# EAGLE design Fyre-BASIC-BOTtom (EAGLE 9.6.2)
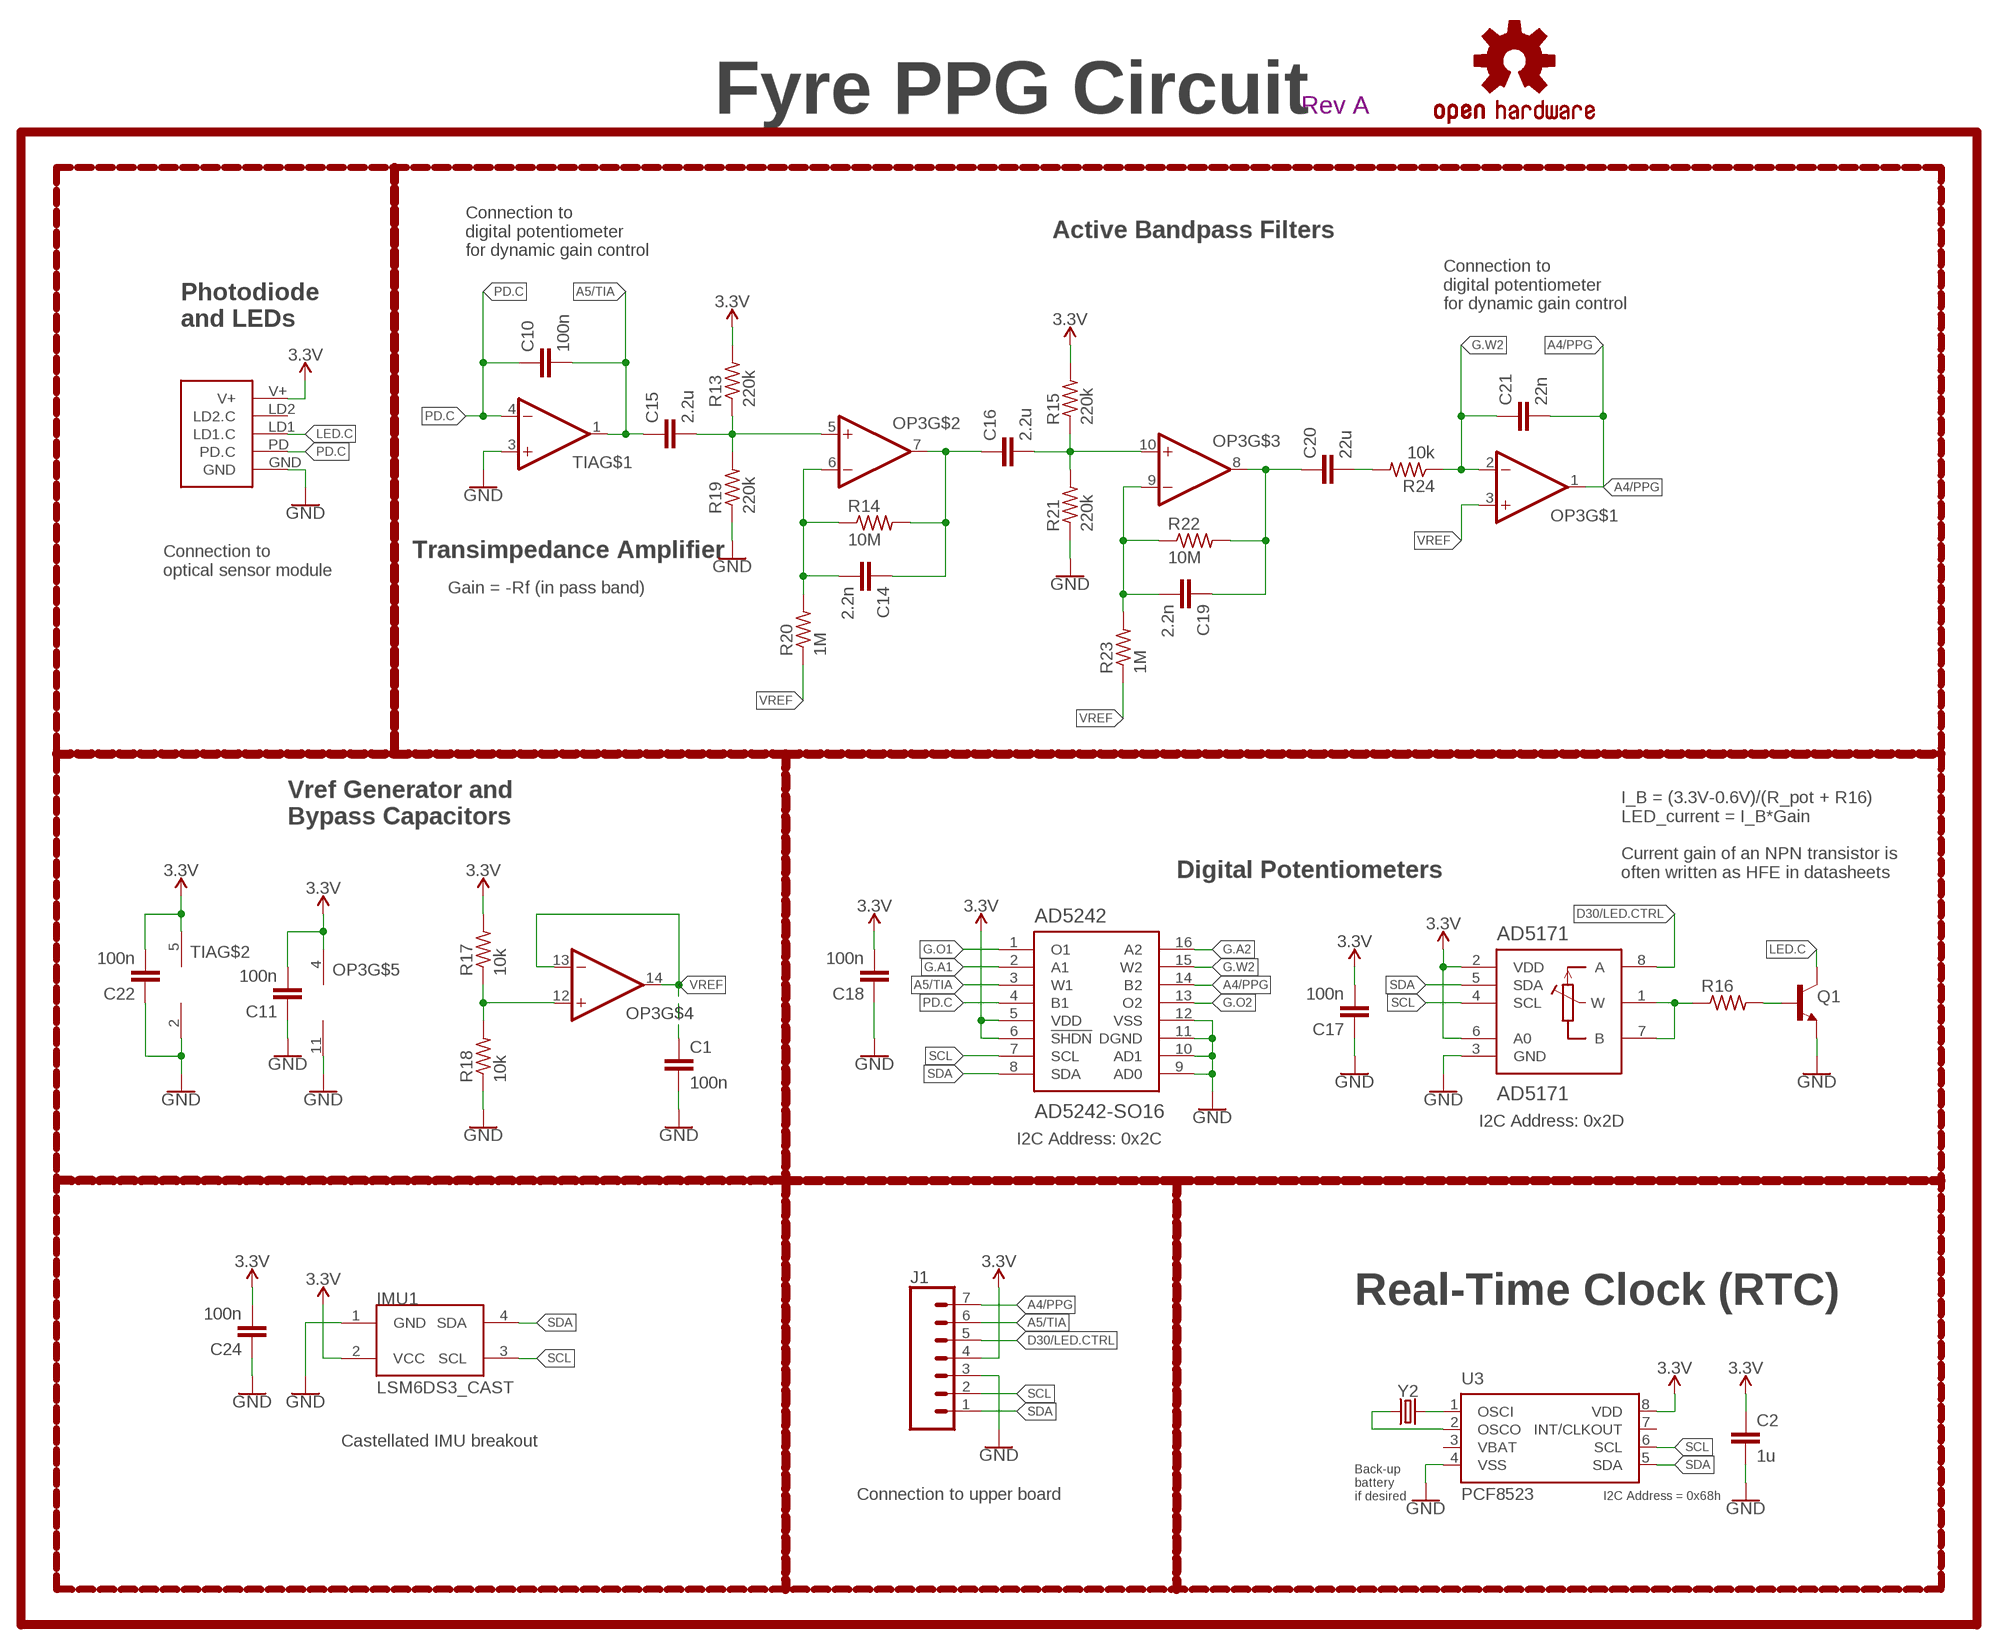
[diagram p0: schematic, sheet 1]

## Parts
AD5171  AD5171  [SOT-23-8]
AD5242  AD5242-SO16  [SO16]
C1  100n  CAPACITOR0603  [C0603]
C2  1u  CAPACITOR0603  [C0603]
C10  100n  CAPACITOR0603  [C0603]
C11  100n  CAPACITOR0603  [C0603]
C14  2.2n  CAPACITOR0603  [C0603]
C15  2.2u  CAPACITOR0603  [C0603]
C16  2.2u  CAPACITOR0603  [C0603]
C17  100n  CAPACITOR0603  [C0603]
C18  100n  CAPACITOR0603  [C0603]
C19  2.2n  CAPACITOR0603  [C0603]
C20  22u  CAPACITOR0603  [C0603]
C21  22n  CAPACITOR0603  [C0603]
C22  100n  CAPACITOR0603  [C0603]
C24  100n  CAPACITOR0603  [C0603]
IMU1  LSM6DS3_CAST  [LSM6DS3_CAST]
J1  CONN_07-1.27MM  [1X07_1.27MM]
LOGO1  REVISION.A  [REV.A]
LOGO2  OSHW-LOGOS  [OSHW-LOGO-S]
OP3  OP-QUAD-SO14  [SO14]
Q1  NPN-GENERIC  [SOT23-3]
R13  220k  RESISTOR0603  [R0603]
R14  10M  RESISTOR0603  [R0603]
R15  220k  RESISTOR0603  [R0603]
R16  RESISTOR0603  [R0603]
R17  10k  RESISTOR0402  [R0402]
R18  10k  RESISTOR0402  [R0402]
R19  220k  RESISTOR0603  [R0603]
R20  1M  RESISTOR0603  [R0603]
R21  220k  RESISTOR0603  [R0603]
R22  10M  RESISTOR0603  [R0603]
R23  1M  RESISTOR0603  [R0603]
R24  10k  RESISTOR0603  [R0603]
TIA  OP-SINGLEOT  [SOT23-5]
U3  PCF8523  [SO8]
U$3  PPG.MODULE.2  [PPG.MODULE.2]
Y2  32.7680kHz  CRYSTALECS-.327-12.5-12-C-TR  [2-SMD.NOLEAD.2.0MMTO1.2MM]

## Nets
3.3V: AD5171.2(VDD) AD5171.6(A0) AD5242.5(VDD) AD5242.6(!SHDN) C2.1 C11.2 C17.2 C18.2 C22.2 C24.2 IMU1.2(VCC) J1.4 OP3.4(V+) R13.2 R15.2 R17.2 TIA.5(V+) U3.8(VDD) U$3.V+
A4/PPG: AD5242.14(B2) C21.2 J1.7 OP3.1(OUT)
A5/TIA: AD5242.3(W1) C10.2 C15.1 J1.6 TIA.1(OUT)
D30/LED.CTRL: AD5171.8(A) J1.5
G.A1: AD5242.2(A1)
G.A2: AD5242.16(A2)
G.O1: AD5242.1(O1)
G.O2: AD5242.13(O2)
G.W2: AD5242.15(W2) C21.1 OP3.2(-IN) R24.1
GND: AD5171.3(GND) AD5242.9(AD0) AD5242.10(AD1) AD5242.11(DGND) AD5242.12(VSS) C1.2 C2.2 C11.1 C17.1 C18.1 C22.1 C24.1 IMU1.1(GND) J1.3 OP3.11(V-) Q1.2(E) R18.1 R19.1 R21.1 TIA.2(V-) TIA.3(+IN) U3.4(VSS) U$3.GND
LED.C: Q1.3(C) U$3.LD1(LD1.C)
N$1: U3.1(OSCI) Y2.P$2
N$6: U3.2(OSCO) Y2.P$1
N$8: Q1.1(B) R16.2
N$9: AD5171.1(W) AD5171.7(B) R16.1
N$10: OP3.12(+IN) R17.1 R18.2
N$13: C15.2 OP3.5(+IN) R13.1 R19.2
N$15: C14.2 OP3.6(-IN) R14.1 R20.2
N$16: C14.1 C16.1 OP3.7(OUT) R14.2
N$17: C16.2 OP3.10(+IN) R15.1 R21.2
N$18: C19.2 OP3.9(-IN) R22.1 R23.2
N$19: C19.1 C20.1 OP3.8(OUT) R22.2
N$20: C20.2 R24.2
PD.C: AD5242.4(B1) C10.1 TIA.4(-IN) U$3.PD(PD.C)
SCL: AD5171.4(SCL) AD5242.7(SCL) IMU1.3(SCL) J1.2 U3.6(SCL)
SDA: AD5171.5(SDA) AD5242.8(SDA) IMU1.4(SDA) J1.1 U3.5(SDA)
VREF: C1.1 OP3.3(+IN) OP3.13(-IN) OP3.14(OUT) R20.1 R23.1
Unconnected: U3.7(INT/CLKOUT) U$3.LD2(LD2.C)

## Notes on the sheet
- Fyre PPG Circuit
- Active Bandpass Filters
- Connection to
  digital potentiometer
  for dynamic gain control
- Connection to
  digital potentiometer
  for dynamic gain control
- Photodiode
  and LEDs
- Transimpedance Amplifier
- Connection to
  optical sensor module
- Gain = -Rf (in pass band)
- Vref Generator and
  Bypass Capacitors
- Digital Potentiometers
- I_B = (3.3V-0.6V)/(R_pot + R16)
  LED_current = I_B*Gain
  
  Current gain of an NPN transistor is
  often written as HFE in datasheets
- I2C Address: 0x2D
- I2C Address: 0x2C
- Real-Time Clock (RTC)
- Castellated IMU breakout
- Connection to upper board
- Back-up
  battery
  if desired
- I2C Address = 0x68h

## Power pins joined to a net without a drawn wire
VBAT: U3.3(VBAT)

## Library data of the parts
AD5171 = LinnesLab-DigitalIC:AD5171
AD5242 = LinnesLab-DigitalIC:AD5242
C1 C2 C10 C11 C14-C22 C24 = LinnesLab-Passives:CAPACITOR
IMU1 = LinnesLab-Sensors:LSM6DS3_CAST
J1 = LinnesLab-Connectors:CONN_07: Multi connection point. Often used as Generic Header-pin footprint for 0.1 inch spaced/style header connections On any of the 0.1 inch spaced packages, you can populate with these: Break Away Headers - Straight <https://www.sparkfun.com/products/116> (PRT-00116) Break Away Male Headers - Right Angle <https://www.sparkfun.com/products/553> (PRT-00553) Female Headers <https://www.sparkfun.com/products/115> (PRT-00115) Break Away Headers - Machine Pin <https://www.sparkfun.com/products/117> (PRT-00117) Break Away Female Headers - Swiss Machine Pin <https://www.sparkfun.com/products/743> (PRT-00743) For SCREWTERMINALS and SPRING TERMINALS visit here: Screw Terimnals on SparkFun.com <https://www.sparkfun.com/search/results?term=Screw+Terminals> (5mm/3.5mm/2.54mm spacing) This device is also useful as a general connection point to wire up your design to another part of your project. Our various solder wires solder well into these plated through hole pads. Hook-Up Wire - Assortment (Stranded, 22 AWG) <https://www.sparkfun.com/products/11375> (PRT-11375) Hook-Up Wire - Assortment (Solid Core, 22 AWG) <https://www.sparkfun.com/products/11367> (PRT-11367) View the entire wire category on our website here <https://www.sparkfun.com/categories/141> Special notes: Molex polarized connector foot print use with SKU : PRT-08231 with associated crimp pins and housings. 1MM SMD Version SKU: PRT-10208 NOTES ON THE VARIANTS LOCK and LOCK_LONGPADS... This footprint was designed to help hold the alignment of a through-hole component (i.e. 6-pin header) while soldering it into place. You may notice that each hole has been shifted either up or down by 0.005 of an inch from it's more standard position (which is a perfectly straight line). This slight alteration caused the pins (the squares in the middle) to touch the edges of the holes. Because they are alternating, it causes a "brace" to hold the component in place. 0.005 has proven to be the perfect amount of "off-center" position when using our standard breakaway headers. Although looks a little odd when you look at the bare footprint, once you have a header in there, the alteration is very hard to notice. Also,if you push a header all the way into place, it is covered up entirely on the bottom side.
LOGO1 = LinnesLab-Logos:REVISION.A
LOGO2 = LinnesLab-Logos:OSHW-LOGO: Open-Source Hardware (OSHW) Logo This logo indicates the piece of hardware it is found on incorporates a OSHW license and/or adheres to the definition of open source hardware found here: http://freedomdefined.org/OSHW
OP3 = LinnesLab-AnalogIC:OP-QUAD: General symbol and footprints for Quad Op Amps. Use with any standard general purpose op amp.
Q1 = LinnesLab-DiscreteSemi:NPN
R13-R24 = LinnesLab-Passives:RESISTOR
TIA = LinnesLab-AnalogIC:OP-SINGLE: Single Op Amp 2.7V to 6.0V Single Supply CMOS Source: http://ww1.microchip.com/downloads/en/DeviceDoc/21314g.pdf
U3 = LinnesLab-Clocks:PCF8523; DIGIKEY: 568-5306-1-ND; I2C_ADDRESS: 0x68h; MFN: PCF8523T/1,118; MFN_MANUFACTURER: NXP USA Inc.
U$3 = LinnesLab-Connectors:PPG.MODULE.2: Digi-Key Part Number: S9014E-50-ND Manufacturer Part Number: GRPB501VWVN-RC Description: 1mm insulation height 0.05in pitch 50 positions
Y2 = LinnesLab-Clocks:CRYSTAL; DIGIKEY: XC2288CT-ND; FREQ: 32.7680KHZ; LOAD_CAP: 12.5pF

## Board
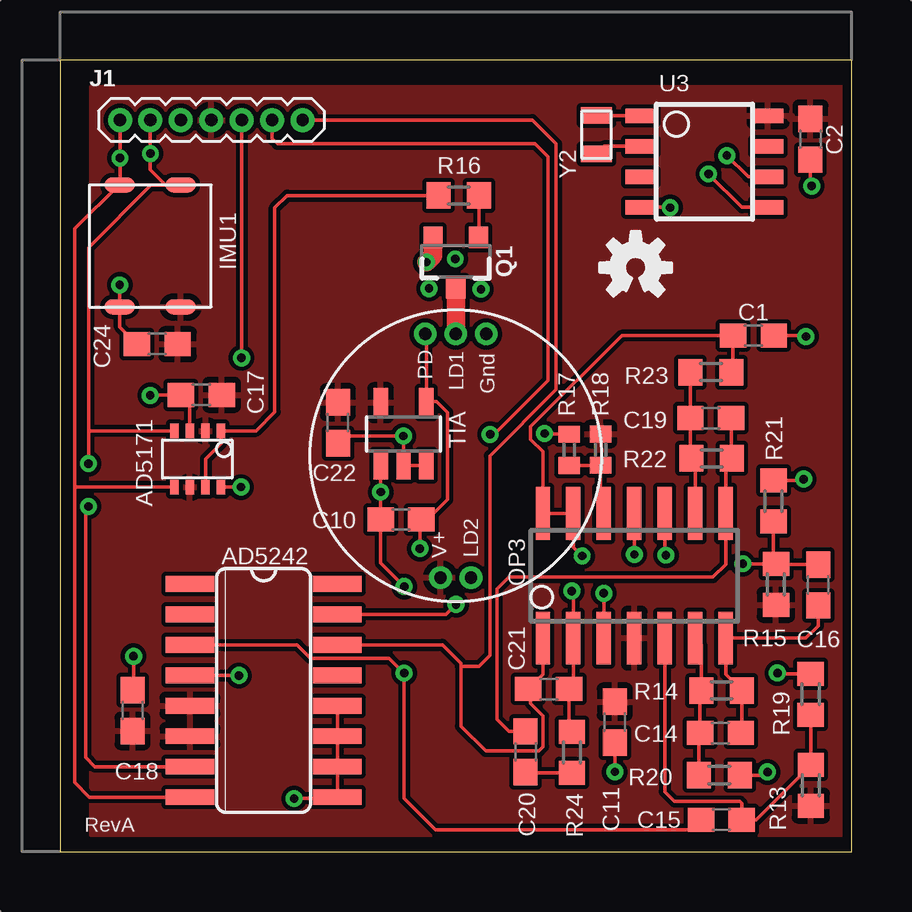
[diagram p1: board, top side]
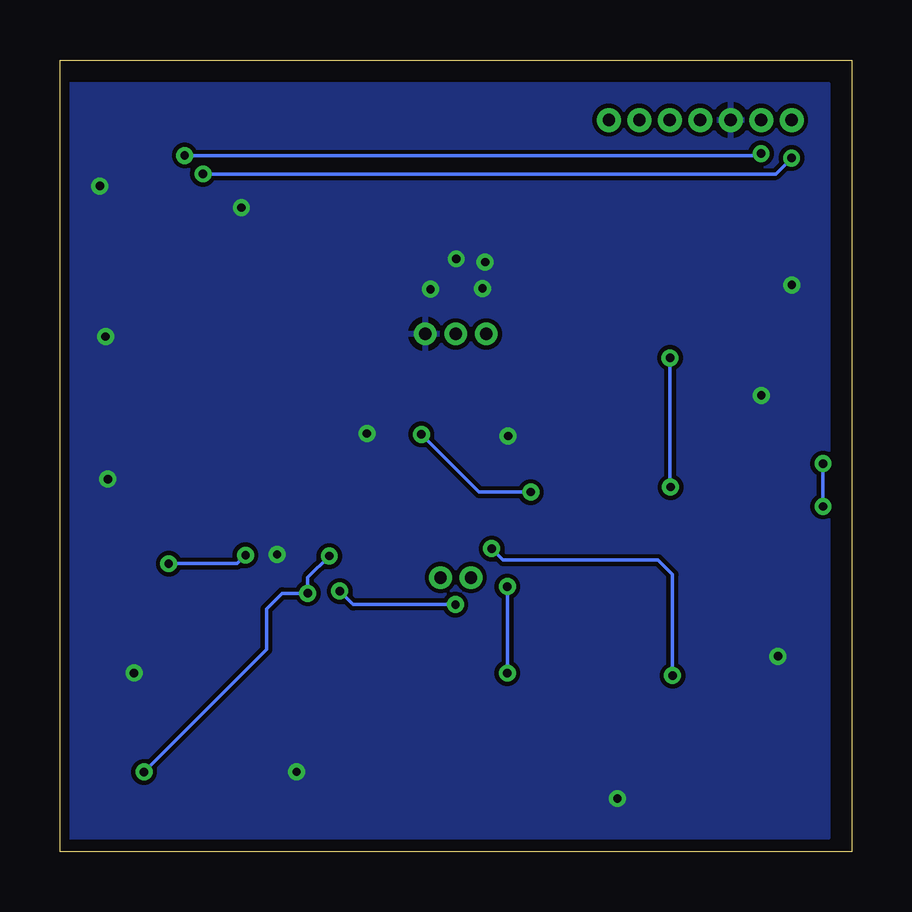
[diagram p2: board, bottom side, seen from below]

Size 33 x 33 mm. Coordinates in mm from the lower left corner, seen from the top.
Outline: 0,0 33,0 33,33 0,33 0,0
Copper layers (1*16): Top 0.0356mm / dielectric 1.5011mm / Bottom 0.0356mm
Design rules "LaenPCBOrder": minimum track width 6mil, minimum drill 13mil, track to track 6mil, track to pad 6mil, pad to pad 6mil, via to via 6mil, smd to smd 6mil, copper to edge 15mil, drill to drill 6mil, minimum pad ring 7mil, minimum via ring 7mil, stop-mask expansion 3mil, vias tented up to drill 0mil, thermal gap 10mil

### Footprints (pad centres in the part's own frame; a part is rotated, then mirrored left to right if it is on the bottom)
SOT-23-8 = smd 0.35 x 0.6: 1 -0.991,-1.176; 2 -0.341,-1.176; 3 0.309,-1.176; 4 0.959,-1.176; 5 0.959,1.176; 6 0.309,1.176; 7 -0.341,1.176; 8 -0.991,1.176
SO16 = smd 0.66 x 2.032: 1 -4.445,-3.073; 2 -3.175,-3.073; 3 -1.905,-3.073; 4 -0.635,-3.073; 5 0.635,-3.073; 6 1.905,-3.073; 7 3.175,-3.073; 8 4.445,-3.073; 9 4.445,3.073; 10 3.175,3.073; 11 1.905,3.073; 12 0.635,3.073; 13 -0.635,3.073; 14 -1.905,3.073; 15 -3.175,3.073; 16 -4.445,3.073
C0603 = smd 1.1 x 1: 1 -0.85,0; 2 0.85,0
LSM6DS3_CAST = smd 0.635 x 1.27: 1 -2.54,1.27; 2 -2.54,-1.27; 3 2.54,-1.27; 4 2.54,1.27
1X07_1.27MM = drill 0.508 pad 1: 1 0,0; 2 1.27,0; 3 2.54,0; 4 3.81,0; 5 5.08,0; 6 6.35,0; 7 7.62,0
SO14 = smd 0.6 x 2.2: 1 -3.81,-2.6; 2 -2.54,-2.6; 3 -1.27,-2.6; 4 0,-2.6; 5 1.27,-2.6; 6 2.54,-2.6; 7 3.81,-2.6; 8 3.81,2.6; 9 2.54,2.6; 10 1.27,2.6; 11 0,2.6; 12 -1.27,2.6; 13 -2.54,2.6; 14 -3.81,2.6
SOT23-3 = smd 0.8 x 0.9: 1 -0.95,-1; 2 0.95,-1; 3 0,1.1
R0603 = smd 1 x 1.1: 1 -0.85,0; 2 0.85,0
R0402 = smd 0.7 x 0.9: 1 -0.65,0; 2 0.65,0
SOT23-5 = smd 0.6 x 1.2: 1 -0.95,-1.306; 2 0,-1.306; 3 0.95,-1.306; 4 0.95,1.306; 5 -0.95,1.306
SO8 = smd 1.3 x 0.6: 1 -2.65,1.905; 2 -2.65,0.635; 3 -2.65,-0.635; 4 -2.65,-1.905; 5 2.65,-1.905; 6 2.65,-0.635; 7 2.65,0.635; 8 2.65,1.905
PPG.MODULE.2 = drill 0.508 pad 0.94: GND 1.27,5.08; LD1 0,5.08; LD2 0.635,-5.08; PD -1.27,5.08; V+ -0.635,-5.08
2-SMD.NOLEAD.2.0MMTO1.2MM = smd 0.7 x 1.3: P$1 -0.8,0; P$2 0.8,0

### Placement (x,y rotation side)
AD5171  5.72,16.36 180 top
AD5242  8.49,6.72 270 top
C1  28.91,21.5 0 top
C2  31.28,29.69 270 top
C10  14.22,13.85 180 top
C11  23.13,5.39 90 top
C14  27.54,4.94 180 top
C15  27.57,1.32 0 top
C16  31.6,11.11 90 top
C17  5.9,19.03 0 top
C18  3.02,5.88 270 top
C19  27.13,18.07 180 top
C20  19.41,4.16 270 top
C21  20.38,6.78 180 top
C22  11.59,17.88 90 top
C24  4.06,21.15 0 top
IMU1  3.76,25.25 90 top
J1  2.5,30.5 0 top
LOGO1  1.03,0.82 0 top
LOGO2  24,24.35 0 top
OP3  23.94,11.5 0 top
Q1  16.5,24.6 180 top
R13  31.3,2.76 270 top
R14  27.59,6.71 0 top
R15  29.85,11.13 270 top
R16  16.63,27.35 0 top
R17  22.54,16.75 90 top
R18  21.23,16.75 270 top
R19  31.29,6.56 270 top
R20  27.48,3.19 180 top
R21  29.75,14.61 270 top
R22  27.17,16.39 0 top
R23  27.13,19.98 180 top
R24  21.35,4.14 270 top
TIA  14.32,17.41 0 top
U3  26.86,28.76 0 top
U$3  16.5,16.5 0 top
Y2  22.36,29.89 90 top

### Tracks (layer width: path | path; a pad name or v marks a point on that pad's centre or on a via)
3.3V
  pour Top (isolate 0.178): 1.28,31.89 32.68,31.89 32.68,0.67 1.28,0.67
A4/PPG
  Top 0.152: OP3.1 20.13,7.39 19.62,6.87 | 19.62,6.87 C21.2 | 19.62,6.87 19.62,6.18 20.14,5.65 20.14,4.37 19.97,4.19 17.75,4.19 16.72,5.23 16.72,7.72 | 16.72,7.72 16.72,7.84 15.94,8.62 AD5242.14 | J1.7 19.69,30.5 20.68,29.51 20.68,19.26 17.92,16.5 17.92,8.18 17.46,7.72 16.72,7.72
A5/TIA  (via drill 0.35)
  Top 0.152: TIA.1 v13.37,14.99 C10.2 13.37,12.02 v14.35,11.05 | C15.1 26.31,0.91 15.66,0.91 14.35,2.22 v14.35,7.44 13.72,8.06 10.45,8.06 9.89,8.62 AD5242.3 | J1.6 8.85,29.72 9.06,29.51 19.8,29.51 20.34,28.97 20.34,19.63 18.1,17.39 v17.93,17.39
  Bottom 0.152: v14.35,11.05 v14.35,7.44 | v17.93,17.39 15.53,14.99 v13.37,14.99
D30/LED.CTRL  (via drill 0.35)
  Top 0.152: J1.5 v7.58,20.59 v7.57,20.58 | v7.55,15.2 7.54,15.19 AD5171.8
  Bottom 0.152: v7.57,20.58 7.57,15.22 v7.55,15.2
G.W2  (via drill 0.35)
  Top 0.152: R24.1 21.23,5.11 C21.1 21.4,6.96 OP3.2 21.4,10.79 v21.34,10.86 | v16.51,10.3 16.1,9.89 AD5242.15
  Bottom 0.152: v16.51,10.3 20.78,10.3 v21.34,10.86
GND  (via drill 0.35)
  Top 0.152: R18.1 20.23,17.4 v20.2,17.43 | OP3.11 v23.94,12.39 v23.95,12.39 | R21.1 30.94,15.46 v31.01,15.53 | R19.1 29.95,7.41 v29.91,7.44 | C11.1 v23.13,3.33 v23.13,3.32 | C18.1 3.07,6.77 v3.07,8.14 | C22.1 11.88,17.32 v14.32,17.32 TIA.2 TIA.3 | AD5242.12 AD5242.11 AD5242.10 AD5242.9 11.5,2.21 v9.76,2.21 | v2.49,23.62 IMU1.1 2.49,21.86 C24.1 | AD5171.3 5.42,18.66 C17.1 3.78,19.03 v3.76,19.01 | C1.2 31.07,21.5 v31.1,21.47 | C2.2 31.28,27.8 v31.34,27.75 | U3.4 25.43,26.86 v25.44,26.84
  Top 0.762: Q1.2 15.55,24.85 v15.27,24.57
  other vias: 17.55,23.44 15.39,23.48 16.48,24.71
  pour Bottom (isolate 0.178): 32.59,32.01 32.59,0.56 0.95,0.56 0.95,32.01
LED.C
  Top 0.762: Q1.3 U$3.LD1
N$1
  Top 0.152: U3.1 22.38,30.67 Y2.P$2
N$6
  Top 0.152: U3.2 22.67,29.4 Y2.P$1
N$8
  Top 0.152: R16.2 17.48,25.63 Q1.1
N$9
  Top 0.152: R16.1 9.47,27.35 8.96,26.83 8.96,18.32 8.17,17.54 AD5171.1 6.71,17.01 6.07,16.37 AD5171.7
N$10
  Top 0.152: R18.2 R17.1 22.54,14.23 OP3.12
N$13
  Top 0.152: R19.2 31.3,5.7 R13.1 29.02,1.32 C15.2 28.42,2.01 28.35,2.08 25.62,2.08 25.21,2.49 OP3.5
N$15
  Top 0.152: OP3.6 26.74,8.65 R14.1 26.69,6.66 C14.2 26.64,4.89 R20.2
N$16
  Top 0.152: C14.1 28.44,5 R14.2 27.75,7.39 OP3.7 31.09,8.9 31.6,9.41 C16.1
N$17  (via drill 0.35)
  Top 0.152: R21.2 29.74,12.09 R15.1 | C16.2 29.87,11.96 R15.1 | R15.1 28.48,11.98 v28.47,12 | v25.26,12.35 25.21,12.4 OP3.10
  Bottom 0.152: v28.47,12 25.61,12 v25.26,12.35
N$18
  Top 0.152: OP3.9 26.48,16.23 R22.1 26.28,16.43 C19.2 R23.2
N$19
  Top 0.152: C20.1 18.72,5.01 18.22,5.5 18.22,10.94 18.72,11.44 27.22,11.44 27.75,11.97 OP3.8 27.75,16.13 R22.2 27.98,16.43 C19.1
N$20
  Top 0.152: C20.2 19.43,3.29 R24.2
PD.C  (via drill 0.35)
  Top 0.152: TIA.4 15.27,18.75 | 15.27,18.75 15.27,21.54 U$3.PD | 15.27,18.75 15.71,18.75 16.15,18.3 16.15,14.67 15.33,13.85 C10.1 15.01,13.79 v15.01,12.63 | AD5242.4 v7.45,7.35 v7.46,7.34
  Bottom 0.152: v7.46,7.34 7.46,11.55 8.07,12.15 14.52,12.15 v15.01,12.63
SCL  (via drill 0.35)
  Top 0.152: J1.2 v3.77,29.1 3.77,28.42 4.4,27.79 IMU1.3 3.79,27.79 1.19,25.19 1.19,17.5 | AD5242.7 1.46,3.54 1.08,3.92 1.08,14.28 v1.19,14.39 | v1.19,16.17 1.19,17.5 | AD5171.4 1.22,17.54 1.19,17.5 | U3.6 28.69,28.13 v27.8,29.01
  Bottom 0.152: v1.19,14.39 v1.19,16.17 | v27.8,29.01 3.86,29.01 v3.77,29.1
SDA  (via drill 0.35)
  Top 0.152: J1.1 v2.5,28.91 2.5,27.85 | 2.5,27.85 IMU1.4 | AD5242.8 1.22,2.27 0.61,2.88 0.61,15.14 | 0.61,15.14 0.61,25.96 2.5,27.85 | AD5171.5 0.65,15.19 0.61,15.14 | U3.5 28.43,26.86 v27.04,28.25
  Bottom 0.152: v27.04,28.25 3.16,28.25 v2.5,28.91
VREF  (via drill 0.35)
  Top 0.152: R20.1 29.37,3.19 v29.49,3.31 | v22.67,10.77 v22.67,10.76 OP3.3 | v21.77,12.32 21.4,12.69 OP3.13 OP3.14 20.13,16.68 19.62,17.18 19.62,17.71 23.42,21.5 C1.1 28.05,20.05 R23.1
  Bottom 0.152: v29.49,3.31 24.39,8.42 24.39,10.11 23.73,10.77 v22.67,10.77 22.67,11.42 v21.77,12.32